# Altium schematic sheet fsm.SchDoc
size A4; SheetNumber: 1; SheetTotal: 1
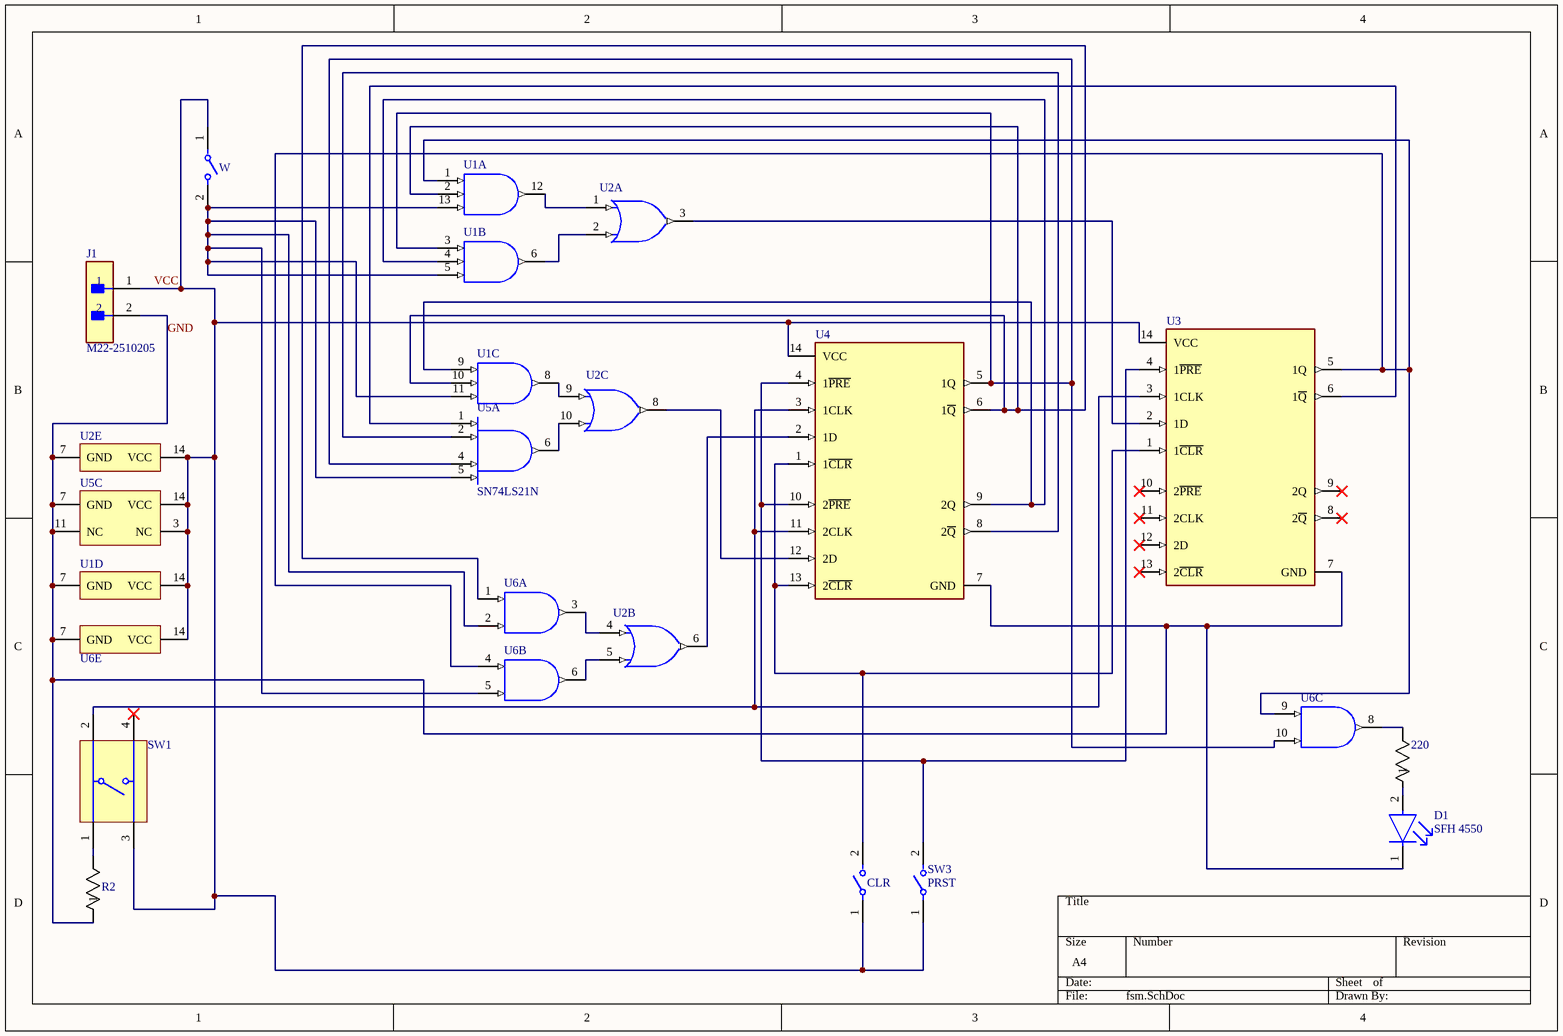
[diagram p0: fsm.SchDoc]

## Parts
220  AC05000002200JAC00  [RES_AC05_VIS]  (value not drawn)
D1  SFH 4550  [FP-SFH_4550-MFG]
J1  M22-2510205  [FP-M22-2510205-MFG]
R2  AC03000001001JAC00  [RES_AC03_VIS]  (value not drawn)
SW1  1825910-6  [TECO-1825910-6_V]  (value not drawn)
SW2  CLR  [FP-BD01-MFG]
SW3  PRST  [FP-BD01-MFG]
U1  SN74LS11N  [N0014A]  (value not drawn)  (parts A,B,C,D of 4)
U2  SN74AHC32N  [N0014A]  (value not drawn)  (parts A,B,C,E of 5)
U3  SN74HCT74N  [FP-N0014A-MFG]  (value not drawn)
U4  SN74HCT74N  [FP-N0014A-MFG]  (value not drawn)
U5  SN74LS21N  [N0014A]  (parts A,C of 3)
U6  SN74AC08N  [N0014A]  (value not drawn)  (parts A,B,C,E of 5)
W  BD01  [FP-BD01-MFG]  (value not drawn)

## Nets
GND: D1.1(C) J1.2 R2.1 U1.7(GND) U2.7(GND) U3.7(GND) U4.7(GND) U5.7(GND) U5.11(NC) U6.7(GND)
VCC: J1.1 SW1.3 SW2.1 SW3.1 U1.14(VCC) U2.14(VCC) U3.14(VCC) U4.14(VCC) U5.3(NC) U5.14(VCC) U6.14(VCC) W.1
Net220_1: 220.1 D1.2(A)
Net220_2: 220.2 U6.8(3Y)
NetR2_2: R2.2 SW1.1
NetSW1_2: SW1.2 U3.3(1CLK) U4.3(1CLK) U4.11(2CLK)
NetSW2_2: SW2.2 U3.1(1~{CLR}) U4.1(1~{CLR}) U4.13(2~{CLR})
NetSW3_2: SW3.2 U3.4(1~{PRE}) U4.4(1~{PRE}) U4.10(2~{PRE})
NetU1_1: U1.1(1A) U3.5(1Q) U6.4(2A) U6.9(3A)
NetU1_2: U1.2(1B) U1.10(3B) U4.6(1~{Q}) U6.1(1A)
NetU1_3: U1.3(2A) U4.5(1Q) U5.4(1C) U6.10(3B)
NetU1_4: U1.4(2B) U1.9(3A) U4.9(2Q)
NetU1_5: U1.5(2C) U1.11(3C) U1.13(1C) U5.5(1D) U6.2(1B) U6.5(2B) W.2
NetU1_6: U1.6(2Y) U2.2(1B)
NetU1_8: U1.8(3Y) U2.9(3A)
NetU1_12: U1.12(1Y) U2.1(1A)
NetU2_3: U2.3(1Y) U3.2(1D)
NetU2_4: U2.4(2A) U6.3(1Y)
NetU2_5: U2.5(2B) U6.6(2Y)
NetU2_6: U2.6(2Y) U4.2(1D)
NetU2_8: U2.8(3Y) U4.12(2D)
NetU2_10: U2.10(3B) U5.6(1Y)
NetU3_6: U3.6(1~{Q}) U5.1(1A)
NetU4_8: U4.8(2~{Q}) U5.2(1B)

Not connected (* = marked no-connect by the designer): SW1 4*; U3 8(2~{Q})* 9(2Q)* 10(2~{PRE})* 11(2CLK)* 12(2D)* 13(2~{CLR})*

## Library data of the parts
220 = CMP-00030-39746845-1: AC05000002200JAC00 Resistor, 220 Ohm, ± 5%, 5 W, Axial Leaded, Wirewound, General Purpose; Lead Diameter: 800µm; Resistance: 220Ω; Voltage Rating: 33V; Temperature Coefficient: -10ppm/°C; Power Rating: 5W; Composition: Wirewound; Min Operating Temperature: -40°C; NexarPartId: 39746845; Radiation Hardening: No; Number of Terminations: 2; Military Standard: Not; RoHS: Compliant; REACH SVHC: Unknown; Contact Plating: Tin; Voltage Rating (DC): 33V; Number of Pins: 2; Tolerance: 5%; Schedule B: 8533210080, 8533210080; Features: Flame Retardant Coating; Diameter: 7.5mm; Max Power Dissipation: 5W; Termination: Axial; Max Operating Temperature: 275°C; Width: 7.493mm; Length: 18mm; Packaging: Cut Tape (CT); Case/Package: Conformal
D1 = CMP-62016-000011-1: EMITTER IR 860NM 100MA RADIAL; Manufacturer: Osram Opto; Forward Voltage: 1.5V; Reverse Voltage: 5V; Viewing Angle: 6°; Led Orientation: Straight; Colour: Infrared; Mouser Description: Infrared Emitters - High Power Infrared 850 nm HALF ANGLE +/-3DEG; RoHS: TRUE; Manufacturer Part Number: SFH 4550; Forward Current: 100mA; Octopart: https://octopart.com/sfh+4550-osram+opto-55410894; ComponentLink2Description: Datasheet; Lead Free: Yes; Temperature: -40°C to +100°C; ComponentLink2URL: https://dammedia.osram.info/media/resource/hires/osram-dam-5580407/SFH%204550_EN.pdf; Device Class L2: LEDs; Temperature Range Low: -40°C; Digikey Description: EMITTER IR 860NM 100MA RADIAL; Temperature Range High: +100°C; Device Class L3: unset; Peak Emmision Wavelength: 860nm; Category: Diode; Package: SFH 4550; Device Class L1: Optoelectronics; Automotive: No
J1 = CMP-15831-000005-1: CONN HEADER VERT 2POS 2MM; Manufacturer: Harwin; Conn Gender: Male; Current Rating: 2A; Number Of Contacts: 2; Conn Orientation: Vertical; Temperature Range Low: -40°C; Device Class L1: Connectors; ComponentLink2URL: https://cdn.harwin.com/pdfs/C018XX_M22_Series_Connectors.pdf; Temperature Range High: +105°C; Pitch: 2mm; Number Of Rows: 1; Temperature: -40°C to +105°C; Automotive: No; Device Class L3: unset; Octopart: https://octopart.com/m22-2510205-harwin-2538221; Mouser Description: Headers & Wire Housings 2 PIN SIL VERTICAL GOLD PIN HEADER; Height: 5.45mm; Category: Conn; Digikey Description: CONN HEADER VERT 2POS 2MM; Contact Material: Gold,Nickel; Lead Free: Yes; ComponentLink2Description: Datasheet; Manufacturer Part Number: M22-2510205; Device Class L2: Headers and Wire Housings; Package: 0; Footprint Url: https://cdn.harwin.com/pdfs/M22-251.pdf; RoHS: TRUE
R2 = CMP-00030-39747202-1: AC03000001001JAC00 Resistor, 1 kOhm, ± 5%, 3 W, Axial Leaded, Wirewound, General Purpose; Temperature Coefficient: 180ppm/°C; Lead Diameter: 800µm; Power Rating: 3W; Resistance: 1kΩ; Voltage Rating (DC): 55V; NexarPartId: 39747202; Max Operating Temperature: 275°C; Contact Plating: Tin; Mount: Through Hole; Min Operating Temperature: -40°C; Width: 4.8mm; Packaging: Cut Tape (CT); Termination: Axial; Number of Pins: 2; Composition: Wirewound; Length: 13mm; Features: Flame Retardant Coating; Schedule B: 8533210080, 8533210080; Diameter: 4.8mm; Max Power Dissipation: 3W; Tolerance: 5%; Voltage Rating: 55V; REACH SVHC: Unknown; Number of Terminations: 2; Radiation Hardening: No; RoHS: Compliant; Military Standard: Not; Case/Package: Axial
SW1 = CMP-1684-00021-1: Tact Switch, SPST-NO, 0.05 A, -35 to 85 degC, 4-Pin THD, RoHS, Bulk; Manufacturer: TE Connectivity; Maximum Contact Resistance: 100mOhm; Mechanical Life: 100000Cycles; Bushing Type: Unthreaded; Switch Configuration: OFF(ON); Maximum DC Voltage Rating: 24V; Contact Rating @ Voltage: 0.05A@24VDC; Actuator Color: Black; Body Orientation: Straight; Function: MomentaryContact; Illumination: N/R; Actuator Style: RoundButton; Actuator Material: PolybutyleneTerephthalate; Dielectric Strength: 500VAC; Pole Throw Configuration: SPST; Actuator Length: 1.4mm; Product Weight: N/A; Contact Material: CopperAlloy; Housing Material: N/A; Terminal Type: PCPins; Minimum Insulation Resistance: 100MOhm; Package Description: 4-Pin Through Hole Device, Body 5.99 x 5.99 mm, Pitch 6.5 mm; Part No: 1825910-6; Package Reference: THD; Base Material: N/A; Manufacturer URL: http://www.te.com; Contact Plating: Silver; RoHS: Yes; Datasheet Version: Rev. C9; Electrical Life: 100000Cycles; Maximum AC Voltage Rating: N/A; Thread Size: N/R; Operating Temperature: -35to85C; Mounting: ThroughHole; Dimension: 5.99x5mm; Datasheet URL: http://www.te.com/commerce/DocumentDelivery/DDEController?Action=showdoc&DocId=Customer+Drawing%7F1825910%7FC9%7Fpdf%7FEnglish%7FENG_CD_1825910_C9.pdf%7F1825910-6; Family: 1825910; Seal Location: N/A; Seal Description: N/A; Packaging: N/A
SW2 SW3 W = CMP-10033-000004-1: SWITCH SLIDE DIP SPST 100MA 5V; Max Voltage Rating (DC): 25V; Contact Current Rating: 25mA; Pitch: 0.1inch; Number of Circuits: 1; Actuator Material: Nylon; Life (Cycles): 10000Cycles; Body Material: PBT; Approvals: UL; Actuator Type: Slide (Standard); Washable: Yes; Actuator Length: 0.9mm; Capacitance: 5pF; Length: 0.18inch; Lead Free: Lead Free; Material: Nylon; Termination: PC Pin; Orientation: Straight; Throw Configuration: SPST; Case/Package: DIP; Package Quantity: 115; Packaging: Rail/Tube; Number of Positions: 1; Max Operating Temperature: 85°C; Terminal Pitch: 2.54mm; Mount: Through Hole; Min Operating Temperature: -40°C; RoHS Compliant: Yes; Depth: 9.65mm; Electrical Life: 10000Cycles; Series: BD; Contact Material: Bronze; Max Current Rating: 100mA; Current Rating: 100mA; Mechanical Life: 10000Cycles; Number of Poles: 1; REACH SVHC: No SVHC; Contact Plating: Gold; Radiation Hardening: No; Width: 9.65mm; Voltage Rating (DC): 5V
U1 = CMP-0777-00254-3: Triple 3-input positive-AND gates, N0014A, TUBE; Manufacturer: Texas Instruments; Output Type: TTL; VCC(Min)(V): 4.75; Technology Family: LS; Bits(#): 3; Voltage(Nom)(V): 5; ICC @ Nom Voltage(Max)(mA): 0.0036; Rating: Catalog; VCC(Max)(V): 5.25; tpd @ Nom Voltage(Max)(ns): 15; Output Drive (IOL/IOH)(Max)(mA): 0/8; F @ Nom Voltage(Max)(Mhz): 35; Schmitt Trigger: No; Input Type: TTL; DatasheetVersion: SDLS131; PackageReference: N0014A; Operating Temperature Range(C): 0 to 70; Generic Part Number: SN74LS11
U2 = CMP-1573-00149-3: Quadruple 2-Input Positive-OR Gates, N0014A, TUBE; Manufacturer: Texas Instruments; Input Type: CMOS; Rating: Catalog; ICC @ Nom Voltage(Max)(mA): 0.02; tpd @ Nom Voltage(Max)(ns): 13,8.5; VCC(Max)(V): 5.5; Output Drive (IOL/IOH)(Max)(mA): 50/-50; Bits(#): 4; VCC(Min)(V): 2; F @ Nom Voltage(Max)(Mhz): 70; Voltage(Nom)(V): 3.3,5; Operating Temperature Range(C): -40 to 125; DatasheetVersion: SCLS247I; PackageReference: N0014A; PackageVersion: http://www.ti.com/lit/ml/mpdi002c/mpdi002c.pdf; Code_JEDEC: MS-001; Generic Part Number: SN74AHC32; Output Type: CMOS
U3 U4 = CMP-1619-00757-3: IC FF D-TYPE DUAL 1BIT 14DIP; Number of Bits: 2; Max Frequency: 24MHz; Clock Edge Trigger Type: Positive Edge; Quiescent Current: 4uA; Turn-On Delay Time: 18ns; High Level Output Current: -4mA; Propagation Delay: 28ns; Output Current: 4mA; Logic Function: AND GATE; Min Supply Voltage: 4.5V; Number of Input Lines: 4; Operating Supply Voltage: 5V; Number of Bits per Element: 1; Frequency: 46MHz; Polarity: Non-Inverting; Max Supply Voltage: 5.5V; Lead Free: Lead Free; Number of Output Lines: 2; Packaging: Rail/Tube; Height: 4.57mm; Contact Plating: Gold; Max Operating Temperature: 85°C; RoHS Compliant: Yes; Number of Elements: 2; Low Level Output Current: 4mA; Case/Package: PDIP; Number of Pins: 14; Radiation Hardening: No; REACH SVHC: No SVHC; Width: 6.35mm; Mount: Through Hole; Package Quantity: 25; Length: 19.3mm; Min Operating Temperature: -40°C; Number of Circuits: 2; Weight: 0.032734oz
U5 = CMP-0777-00260-3: Dual 4-input positive-AND gates, N0014A, TUBE; Manufacturer: Texas Instruments; VCC(Min)(V): 4.75; Output Type: TTL; Voltage(Nom)(V): 5; tpd @ Nom Voltage(Max)(ns): 15; Schmitt Trigger: No; VCC(Max)(V): 5.25; Rating: Catalog; Technology Family: LS; ICC @ Nom Voltage(Max)(mA): 0.0025; Output Drive (IOL/IOH)(Max)(mA): -.04/8; Bits(#): 2; F @ Nom Voltage(Max)(Mhz): 35; DatasheetVersion: SDLS139; Generic Part Number: SN74LS21; PackageReference: N0014A; Input Type: TTL; Operating Temperature Range(C): 0 to 70
U6 = CMP-0777-00256-3: Quadruple 2-Input Positive-AND Gates, N0014A, TUBE; Manufacturer: Texas Instruments; Output Type: CMOS; Bits(#): 4; Voltage(Nom)(V): 3.3,5; ICC @ Nom Voltage(Max)(mA): 0.02; F @ Nom Voltage(Max)(Mhz): 100; VCC(Min)(V): 2; Schmitt Trigger: No; Rating: Catalog; Output Drive (IOL/IOH)(Max)(mA): -24/24; tpd @ Nom Voltage(Max)(ns): 10,8.5; Technology Family: AC; VCC(Max)(V): 6; DatasheetVersion: SCAS536D; Generic Part Number: SN74AC08; PackageReference: N0014A; Input Type: CMOS; Operating Temperature Range(C): -40 to 85